# EAGLE design DRV10987 (EAGLE 8.7.1)
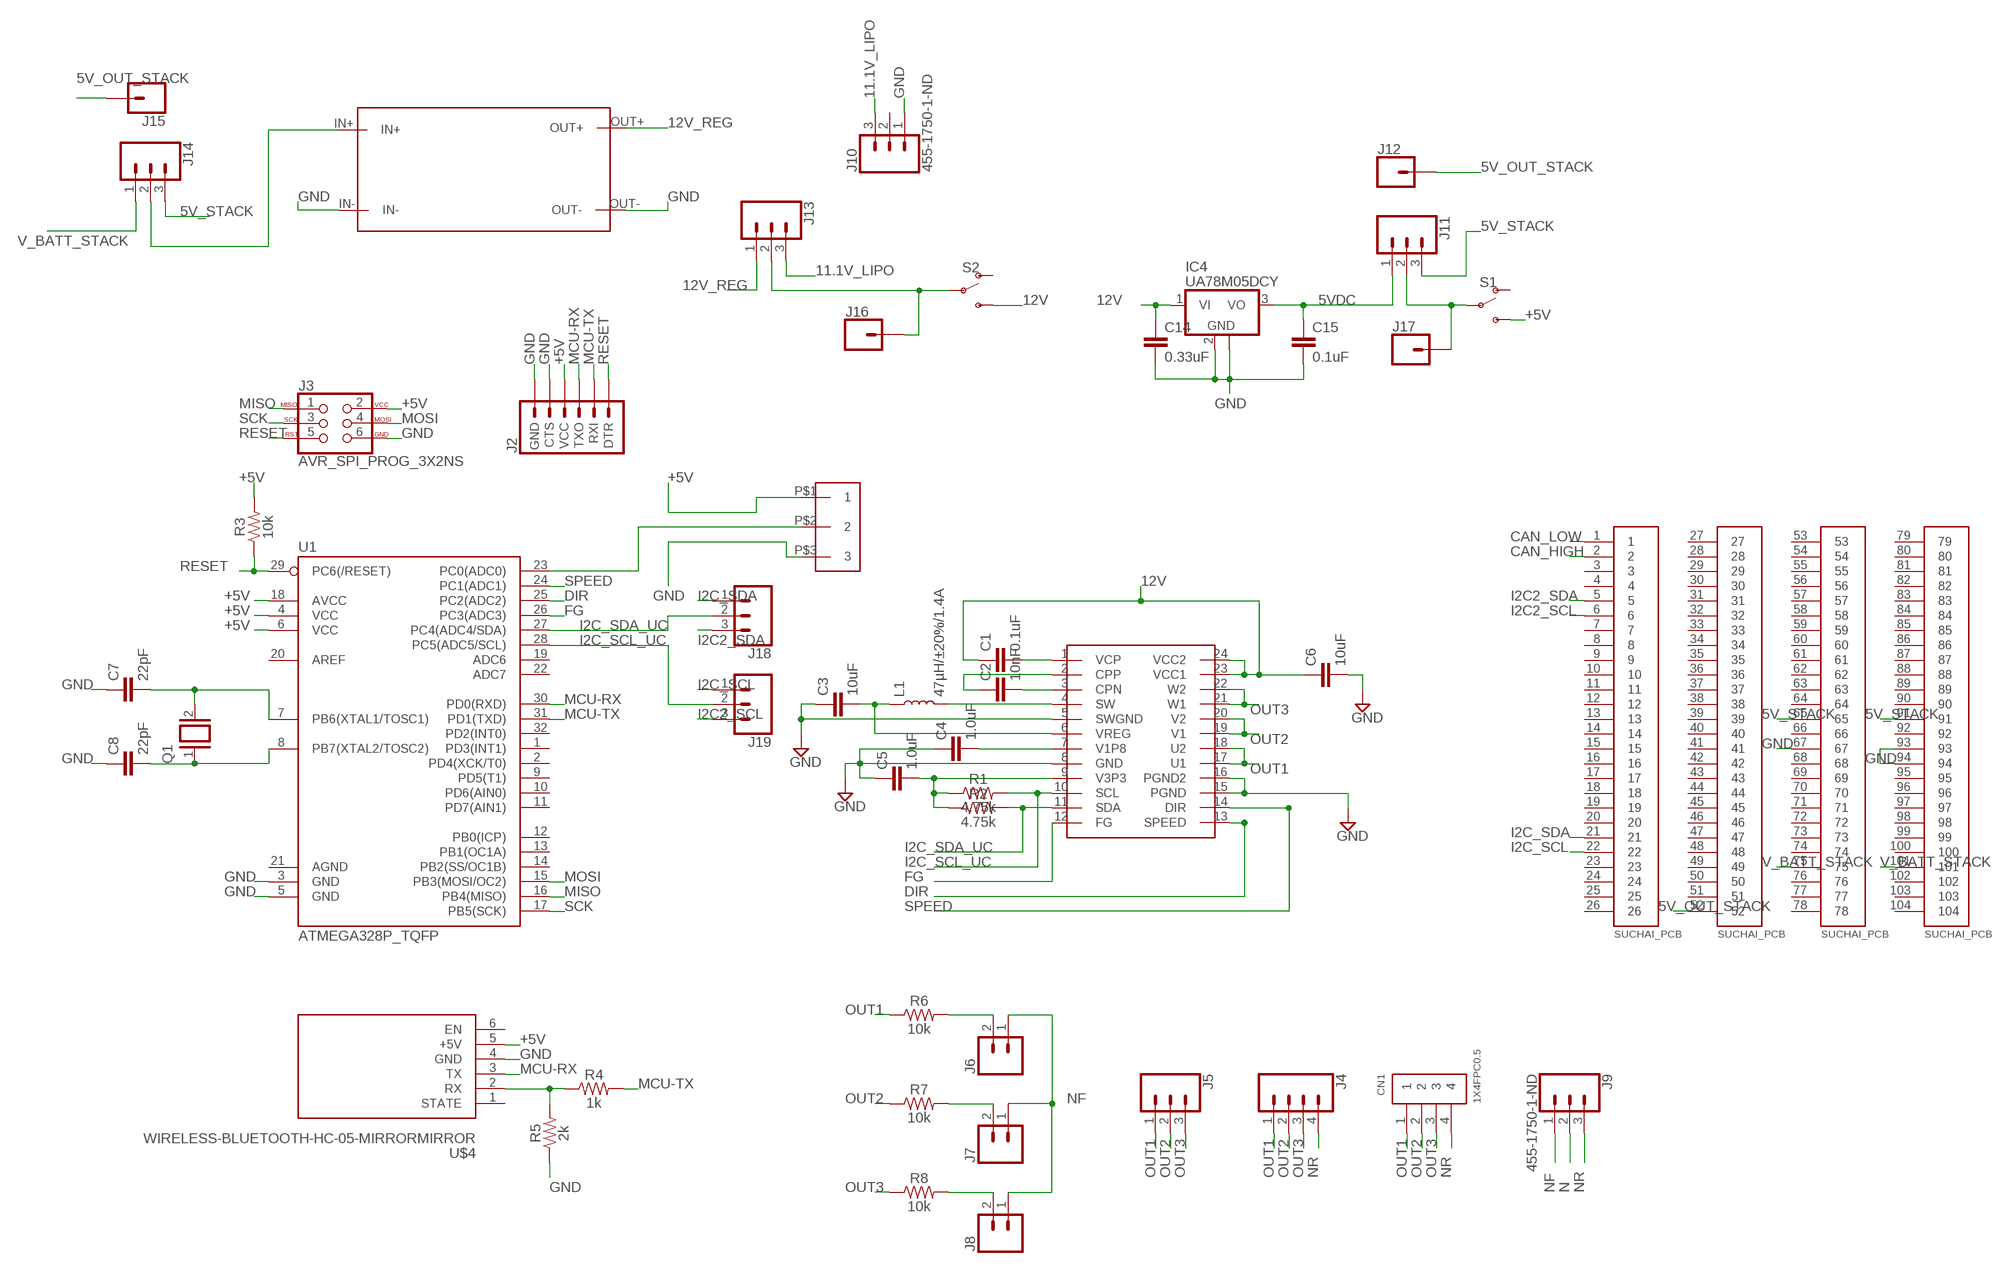
[diagram p0: schematic, sheet 1]

## Parts
C1  0.1uF  1.0UF-0805-25V-10%  [0805]
C2  10nF  1.0UF-0805-25V-10%  [0805]
C3  10uF  1.0UF-0805-25V-10%  [0805]
C4  1.0uF  1.0UF-0805-25V-10%  [0805]
C5  1.0uF  1.0UF-0805-25V-10%  [0805]
C6  10uF  1.0UF-0805-25V-10%  [0805]
C7  22pF  2.2UF-1206-50V-10%  [1206]
C8  22pF  2.2UF-1206-50V-10%  [1206]
C14  0.33uF  1.0UF-1206-50V-10%  [1206]
C15  0.1uF  1.0UF-1206-50V-10%  [1206]
CN1  1X4FPC0.5  [FPC_0.5MM-4]
IC4  UA78M05DCY  [SOT223]
J1  SUCHAI_PCB  [SUCHAI_PCB]
J2  6_PIN_SERIAL_TARGET  [1X06]
J3  AVR_SPI_PROG_3X2NS  [2X3-NS]
J4  CONN_04  [1X04]
J5  CONN_03-SCREW-5MM  [SCREWTERMINAL-5MM-3]
J6  CONN_02  [1X02]
J7  CONN_02  [1X02]
J8  CONN_02  [1X02]
J9  455-1750-1-ND  CONN_03  [1X03]
J10  455-1750-1-ND  CONN_03  [1X03]
J11  CONN_03LOCK  [1X03_LOCK]
J12  CONN_01  [1X01]
J13  CONN_03LOCK  [1X03_LOCK]
J14  CONN_03LOCK  [1X03_LOCK]
J15  CONN_01  [1X01]
J16  CONN_01  [1X01]
J17  CONN_01  [1X01]
J18  CONN_03LOCK  [1X03_LOCK]
J19  CONN_03LOCK  [1X03_LOCK]
L1  47µH/±20%/1.4A  INDUCTOR-SRN6045-33UH  [SRN6045]
Q1  XTAL/S  [QS]
R1  4.75k  RESISTOR0805  [0805]
R2  4.75k  RESISTOR0805  [0805]
R3  10k  RESISTOR1206  [1206]
R4  1k  1KOHM-HORIZ-1/4W-5%  [AXIAL-0.3]
R5  2k  RESISTORAXIAL-0.3  [AXIAL-0.3]
R6  10k  10KOHM-HORIZ-1/4W-1%  [AXIAL-0.3]
R7  10k  10KOHM-HORIZ-1/4W-1%  [AXIAL-0.3]
R8  10k  10KOHM-HORIZ-1/4W-1%  [AXIAL-0.3]
S1  SWITCH-SPDT-PTH-11.6X4.0MM  [SWITCH_SPDT_PTH_11.6X4.0MM]
S2  SWITCH-SPDT-PTH-11.6X4.0MM  [SWITCH_SPDT_PTH_11.6X4.0MM]
U1  ATMEGA328P_TQFP  [TQFP32-08]
U$1  DRV10987  [DRV10987]
U$2  XL6009E1_MODULE  [XL6009E1_MODULE]
U$3  CONN_03_SMD_SMALL  [CONN_03_SMD_SMALL]
U$4  WIRELESS-BLUETOOTH-HC-05-MIRRORMIRROR  [WIRELESS-BLUETOOTH-HC-05-MIRROR]

## Nets
5V_OUT_STACK: J1.52 J12.1 J15.1
5V_STACK: J1.65 J1.91 J11.3 J14.3
5VDC: C15.1 IC4.3(VO) J11.1
11.1V_LIPO: J10.3 J13.3
12V: C1.1 C6.1 C14.1 IC4.1(VI) S2.3(S) U$1.23(VCC1) U$1.24(VCC2)
12V_REG: J13.1 U$2.OUT+
+5V: J2.4(VCC) J3.2 R3.2 S1.3(S) U1.4(VCC) U1.6(VCC) U1.18(AVCC) U$3.P$1 U$4.5(+5V)
CAN_HIGH: J1.2
CAN_LOW: J1.1
DIR: U1.25(PC2(ADC2)) U$1.13(SPEED)
FG: U1.26(PC3(ADC3)) U$1.12(FG)
GND: C3.1 C4.1 C5.1 C6.2 C7.1 C8.1 C14.2 C15.2 IC4.2(GND) IC4.4(GND) J1.67 J1.93 J1.94 J2.5(CTS) J2.6(GND) J3.6 J10.1 R5.P$1 U1.3(GND) U1.5(GND) U$1.5(SWGND) U$1.8(GND) U$1.15(PGND) U$1.16(PGND2) U$2.IN- U$2.OUT- U$3.P$3 U$4.4(GND)
I2C2_SCL: J1.6 J19.3
I2C2_SDA: J1.5 J18.3
I2C_SCL: J1.22 J19.1
I2C_SCL_UC: J19.2 R1.2 U1.28(PC5(ADC5/SCL)) U$1.10(SCL)
I2C_SDA: J1.21 J18.1
I2C_SDA_UC: J18.2 R2.2 U1.27(PC4(ADC4/SDA)) U$1.11(SDA)
MCU-RX: J2.3(TXO) U1.30(PD0(RXD)) U$4.3(TX)
MCU-TX: J2.2(RXI) R4.P$2 U1.31(PD1(TXD))
MISO: J3.1 U1.16(PB4(MISO))
MOSI: J3.4 U1.15(PB3(MOSI/OC2))
N: J9.2
N$1: C1.2 U$1.1(VCP)
N$2: C2.1 U$1.2(CPP)
N$3: C2.2 U$1.3(CPN)
N$4: L1.2 U$1.4(SW)
N$5: J11.2 J17.1 S1.2(P)
N$6: C3.2 L1.1 U$1.6(VREG)
N$7: C4.2 U$1.7(V1P8)
N$8: C7.2 Q1.2 U1.7(PB6(XTAL1/TOSC1))
N$9: C5.2 R1.1 R2.1 U$1.9(V3P3)
N$10: C8.2 Q1.1 U1.8(PB7(XTAL2/TOSC2))
N$11: J7.2 R7.P$2
N$12: J6.2 R6.P$2
N$13: R4.P$1 R5.P$2 U$4.2(RX)
N$14: U1.23(PC0(ADC0)) U$3.P$2
N$15: J8.2 R8.P$2
N$16: J13.2 J16.1 S2.2(P)
N$18: J14.2 U$2.IN+
NF: J6.1 J7.1 J8.1 J9.1
NR: CN1.4 J4.4 J9.3
OUT1: CN1.1 J4.1 J5.1 R6.P$1 U$1.17(U1) U$1.18(U2)
OUT2: CN1.2 J4.2 J5.2 R7.P$1 U$1.19(V1) U$1.20(V2)
OUT3: CN1.3 J4.3 J5.3 R8.P$1 U$1.21(W1) U$1.22(W2)
RESET: J2.1(DTR) J3.5 R3.1 U1.29(PC6(/RESET))
SCK: J3.3 U1.17(PB5(SCK))
SPEED: U1.24(PC1(ADC1)) U$1.14(DIR)
V_BATT_STACK: J1.75 J1.101 J14.1
Unconnected: J1.3 J1.4 J1.7 J1.8 J1.9 J1.10 J1.11 J1.12 J1.13 J1.14 J1.15 J1.16 J1.17 J1.18 J1.19 J1.20 J1.23 J1.24 J1.25 J1.26 J1.27 J1.28 J1.29 J1.30 J1.31 J1.32 J1.33 J1.34 J1.35 J1.36 J1.37 J1.38 J1.39 J1.40 J1.41 J1.42 J1.43 J1.44 J1.45 J1.46 J1.47 J1.48 J1.49 J1.50 J1.51 J1.53 J1.54 J1.55 J1.56 J1.57 J1.58 J1.59 J1.60 J1.61 J1.62 J1.63 J1.64 J1.66 J1.68 J1.69 J1.70 J1.71 J1.72 J1.73 J1.74 J1.76 J1.77 J1.78 J1.79 J1.80 J1.81 J1.82 J1.83 J1.84 J1.85 J1.86 J1.87 J1.88 J1.89 J1.90 J1.92 J1.95 J1.96 J1.97 J1.98 J1.99 J1.100 J1.102 J1.103 J1.104 J10.2 S1.1(O) S2.1(O) U1.1(PD3(INT1)) U1.2(PD4(XCK/T0)) U1.9(PD5(T1)) U1.10(PD6(AIN0)) U1.11(PD7(AIN1)) U1.12(PB0(ICP)) U1.13(PB1(OC1A)) U1.14(PB2(SS/OC1B)) U1.19(ADC6) U1.20(AREF) U1.21(AGND) U1.22(ADC7) U1.32(PD2(INT0)) U$4.1(STATE) U$4.6(EN)

## Library data of the parts
C1-C3 C6 = SparkFun-Capacitors:1.0UF: 1µF ceramic capacitors A capacitor is a passive two-terminal electrical component used to store electrical energy temporarily in an electric field.; PROD_ID: CAP-08064; VALUE: 1.0uF
C4 C5 = SparkFun-Capacitors:1.0UF: 1µF ceramic capacitors A capacitor is a passive two-terminal electrical component used to store electrical energy temporarily in an electric field.; PROD_ID: CAP-08064
C7 C8 = SparkFun-Capacitors:2.2UF: 2.2µF ceramic capacitors A capacitor is a passive two-terminal electrical component used to store electrical energy temporarily in an electric field.; PROD_ID: CAP-10009; VALUE: 2.2uF
C14 C15 = SparkFun-Capacitors:1.0UF: 1µF ceramic capacitors A capacitor is a passive two-terminal electrical component used to store electrical energy temporarily in an electric field.; PROD_ID: CAP-09822; VALUE: 1.0uF
CN1 = adafruit:1X4: 4-pin connector
IC4 = linear:UA78M*: POSITIVE-VOLTAGE REGULATORS Source: http://focus.ti.com/lit/ds/symlink/ua78m33.pdf
J1 = SUCHAI_PCB:SUCHAI_PCB: ASSEMBLY, SOCKET STRIP .016 X .031 TAIL.
J2 = SparkFun-Connectors:6_PIN_SERIAL_TARGET: 6-pin header connection for use with the "FTDI BASIC" pinout - TARGET SIDE. Also known as "Arduino Serial Program Header". It is used to mate with our FTDI Basic serial programmers using the Arduino IDE. Note, this device has "TARGET" in the name. It is intended to be used on a design that contains a target micro-controller that you wish to program. The "sister" device, named "CABLE" is inteneded to be used on a design that usually lives on the end of your USB cable and prvides the converter chip (FTDI232 or FTDI231x) to commnicate serial RX/TX. You can populate with some of these: Break Away Headers - Straight <https://www.sparkfun.com/products/116> (PRT-00116) For reference (or to suit your programming needs) check out these designs: SparkFun FTDI Basic Breakout - 5V <https://www.sparkfun.com/products/9716> (DEV-09716) SparkFun FTDI Basic Breakout - 3.3V <https://www.sparkfun.com/products/9873> (DEV-09873) SparkFun FTDI SmartBasic <https://www.sparkfun.com/products/12935> (DEV-12935) SparkFun Beefy 3 - FTDI Basic Breakout <https://www.sparkfun.com/products/13746> (DEV-13746)
J3 = SparkFun-Connectors:AVR_SPI_PROG_3X2: AVR ISP 6 Pin This is the reduced ISP connector for AVR programming. Common on Arduino. This footprint will take up less PCB space and can be used with a 10-pin to 6-pin adapter such as SKU: BOB-08508 **Special note about "TEST_POINT" package. The stop mask is on the top side, so if you want your programming test points to be on the bottom of your board, make sure to place this package on the bottom side of the board. This also ensure that the orientation to program from the bottom side will be correct. SparkFun Products: SparkFun ISP Pogo Adapter <https://www.sparkfun.com/products/11591> - NS Tiny AVR Programmer <https://www.sparkfun.com/products/11801> -PTH
J4 = SparkFun-Connectors:CONN_04: Multi connection point. Often used as Generic Header-pin footprint for 0.1 inch spaced/style header connections On any of the 0.1 inch spaced packages, you can populate with these: Break Away Headers - Straight <https://www.sparkfun.com/products/116> (PRT-00116) Break Away Male Headers - Right Angle <https://www.sparkfun.com/products/553> (PRT-00553) Female Headers <https://www.sparkfun.com/products/115> (PRT-00115) Break Away Headers - Machine Pin <https://www.sparkfun.com/products/117> (PRT-00117) Break Away Female Headers - Swiss Machine Pin <https://www.sparkfun.com/products/743> (PRT-00743) For SCREWTERMINALS and SPRING TERMINALS visit here: Screw Terimnals on SparkFun.com <https://www.sparkfun.com/search/results?term=Screw+Terminals> (5mm/3.5mm/2.54mm spacing) This device is also useful as a general connection point to wire up your design to another part of your project. Our various solder wires solder well into these plated through hole pads. Hook-Up Wire - Assortment (Stranded, 22 AWG) <https://www.sparkfun.com/products/11375> (PRT-11375) Hook-Up Wire - Assortment (Solid Core, 22 AWG) <https://www.sparkfun.com/products/11367> (PRT-11367) View the entire wire category on our website here <https://www.sparkfun.com/categories/141> Special notes: Molex polarized connector foot print use with SKU : PRT-08231 with associated crimp pins and housings. 1MM SMD Version SKU: PRT-10208; PROD_ID: CONN-09696
J5 = SparkFun-Connectors:CONN_03: Multi connection point. Often used as Generic Header-pin footprint for 0.1 inch spaced/style header connections On any of the 0.1 inch spaced packages, you can populate with these: Break Away Headers - Straight <https://www.sparkfun.com/products/116> (PRT-00116) Break Away Male Headers - Right Angle <https://www.sparkfun.com/products/553> (PRT-00553) Female Headers <https://www.sparkfun.com/products/115> (PRT-00115) Break Away Headers - Machine Pin <https://www.sparkfun.com/products/117> (PRT-00117) Break Away Female Headers - Swiss Machine Pin <https://www.sparkfun.com/products/743> (PRT-00743) Stackable Header - 3 Pin (Female, 0.1") <https://www.sparkfun.com/products/13875> (PRT-13875) For SCREWTERMINALS and SPRING TERMINALS visit here: Screw Terimnals on SparkFun.com <https://www.sparkfun.com/search/results?term=Screw+Terminals> (5mm/3.5mm/2.54mm spacing) This device is also useful as a general connection point to wire up your design to another part of your project. Our various solder wires solder well into these plated through hole pads. Hook-Up Wire - Assortment (Stranded, 22 AWG) <https://www.sparkfun.com/products/11375> (PRT-11375) Hook-Up Wire - Assortment (Solid Core, 22 AWG) <https://www.sparkfun.com/products/11367> (PRT-11367) View the entire wire category on our website here <https://www.sparkfun.com/categories/141> Special notes: Molex polarized connector foot print use with SKU : PRT-08232 with associated crimp pins and housings.; PROD_ID: CONN-10134; SF_SKU: PRT-08433
J6-J8 = SparkFun-Connectors:CONN_02: Multi connection point. Often used as Generic Header-pin footprint for 0.1 inch spaced/style header connections On any of the 0.1 inch spaced packages, you can populate with these: Break Away Headers - Straight <https://www.sparkfun.com/products/116> (PRT-00116) Break Away Male Headers - Right Angle <https://www.sparkfun.com/products/553> (PRT-00553) Female Headers <https://www.sparkfun.com/products/115> (PRT-00115) Break Away Headers - Machine Pin <https://www.sparkfun.com/products/117> (PRT-00117) Break Away Female Headers - Swiss Machine Pin <https://www.sparkfun.com/products/743> (PRT-00743) For SCREWTERMINALS and SPRING TERMINALS visit here: Screw Terimnals on SparkFun.com <https://www.sparkfun.com/search/results?term=Screw+Terminals> (5mm/3.5mm/2.54mm spacing) This device is also useful as a general connection point to wire up your design to another part of your project. Our various solder wires solder well into these plated through hole pads. Hook-Up Wire - Assortment (Stranded, 22 AWG) <https://www.sparkfun.com/products/11375> (PRT-11375) Hook-Up Wire - Assortment (Solid Core, 22 AWG) <https://www.sparkfun.com/products/11367> (PRT-11367) View the entire wire category on our website here <https://www.sparkfun.com/categories/141> Special notes: Molex polarized connector foot print use with: PRT-08233 with associated crimp pins and housings. 2.54_SCREWTERM for use with PRT-10571. 3.5mm Screw Terminal footprints for PRT-08084 5mm Screw Terminal footprints for use with PRT-08432
J9 J10 = SparkFun-Connectors:CONN_03: Multi connection point. Often used as Generic Header-pin footprint for 0.1 inch spaced/style header connections On any of the 0.1 inch spaced packages, you can populate with these: Break Away Headers - Straight <https://www.sparkfun.com/products/116> (PRT-00116) Break Away Male Headers - Right Angle <https://www.sparkfun.com/products/553> (PRT-00553) Female Headers <https://www.sparkfun.com/products/115> (PRT-00115) Break Away Headers - Machine Pin <https://www.sparkfun.com/products/117> (PRT-00117) Break Away Female Headers - Swiss Machine Pin <https://www.sparkfun.com/products/743> (PRT-00743) Stackable Header - 3 Pin (Female, 0.1") <https://www.sparkfun.com/products/13875> (PRT-13875) For SCREWTERMINALS and SPRING TERMINALS visit here: Screw Terimnals on SparkFun.com <https://www.sparkfun.com/search/results?term=Screw+Terminals> (5mm/3.5mm/2.54mm spacing) This device is also useful as a general connection point to wire up your design to another part of your project. Our various solder wires solder well into these plated through hole pads. Hook-Up Wire - Assortment (Stranded, 22 AWG) <https://www.sparkfun.com/products/11375> (PRT-11375) Hook-Up Wire - Assortment (Solid Core, 22 AWG) <https://www.sparkfun.com/products/11367> (PRT-11367) View the entire wire category on our website here <https://www.sparkfun.com/categories/141> Special notes: Molex polarized connector foot print use with SKU : PRT-08232 with associated crimp pins and housings.; PROD_ID: XXX-00000
J11 J13 J14 J18 J19 = SparkFun-Connectors:CONN_03: Multi connection point. Often used as Generic Header-pin footprint for 0.1 inch spaced/style header connections On any of the 0.1 inch spaced packages, you can populate with these: Break Away Headers - Straight <https://www.sparkfun.com/products/116> (PRT-00116) Break Away Male Headers - Right Angle <https://www.sparkfun.com/products/553> (PRT-00553) Female Headers <https://www.sparkfun.com/products/115> (PRT-00115) Break Away Headers - Machine Pin <https://www.sparkfun.com/products/117> (PRT-00117) Break Away Female Headers - Swiss Machine Pin <https://www.sparkfun.com/products/743> (PRT-00743) Stackable Header - 3 Pin (Female, 0.1") <https://www.sparkfun.com/products/13875> (PRT-13875) For SCREWTERMINALS and SPRING TERMINALS visit here: Screw Terimnals on SparkFun.com <https://www.sparkfun.com/search/results?term=Screw+Terminals> (5mm/3.5mm/2.54mm spacing) This device is also useful as a general connection point to wire up your design to another part of your project. Our various solder wires solder well into these plated through hole pads. Hook-Up Wire - Assortment (Stranded, 22 AWG) <https://www.sparkfun.com/products/11375> (PRT-11375) Hook-Up Wire - Assortment (Solid Core, 22 AWG) <https://www.sparkfun.com/products/11367> (PRT-11367) View the entire wire category on our website here <https://www.sparkfun.com/categories/141> Special notes: Molex polarized connector foot print use with SKU : PRT-08232 with associated crimp pins and housings.
J12 J15-J17 = SparkFun-Connectors:CONN_01: Single connection point. Often used as Generic Header-pin footprint for 0.1 inch spaced/style header connections On any of the 0.1 inch spaced packages, you can populate with these: Break Away Headers - Straight <https://www.sparkfun.com/products/116> (PRT-00116) Break Away Male Headers - Right Angle <https://www.sparkfun.com/products/553> (PRT-00553) Female Headers <https://www.sparkfun.com/products/115> (PRT-00115) Break Away Headers - Machine Pin <https://www.sparkfun.com/products/117> (PRT-00117) Break Away Female Headers - Swiss Machine Pin <https://www.sparkfun.com/products/743> (PRT-00743) This device is also useful as a general connection point to wire up your design to another part of your project. Our various solder wires solder well into these plated through hole pads. Hook-Up Wire - Assortment (Stranded, 22 AWG) <https://www.sparkfun.com/products/11375> (PRT-11375) Hook-Up Wire - Assortment (Solid Core, 22 AWG) <https://www.sparkfun.com/products/11367> (PRT-11367) View the entire wire category on our website here <https://www.sparkfun.com/categories/141> Special notes: SMTSO-256-ET is a "flush mount" nut for a 4-40 screw. We mostly use this on specialty testbeds; it is a nice way to connect hardware to your PCB at an adjustable hieght. Also note, the SNAP packages are for using a snappable style connector. We sell a baggie of snaps and they are also used on two LilyPad designs: Snap Assortment - 30 pack (male and female) <https://www.sparkfun.com/products/11347> (DEV-11347) LilyPad Arduino SimpleSnap <https://www.sparkfun.com/products/10941> (DEV-10941) LilyPad SimpleSnap Protoboard <https://www.sparkfun.com/products/10940> (DEV-10940)
L1 = SparkFun-Coils:INDUCTOR: Inductors Resist changes in electrical current. Basically a coil of wire. SparkFun Products: SparkFun Load Cell Amplifier - HX711 <https://www.sparkfun.com/products/13879> IOIO-OTG - V2.2 <https://www.sparkfun.com/products/13613>; PROD_ID: NDUC-11627; VALUE: 33µH/±20%/1.4A
Q1 = special:XTAL/S: CRYSTAL
R1-R3 = SparkFun-Resistors:RESISTOR: Generic Resistor Package
R4 = resistors-longpads:1KOHM: 1kΩ resistor A resistor is a passive two-terminal electrical component that implements electrical resistance as a circuit element. Resistors act to reduce current flow, and, at the same time, act to lower voltage levels within circuits. - Wikipedia; PROD_ID: RES-08380
R5 = resistors-longpads:RESISTOR: Generic Resistor Package
R6-R8 = SparkFun-Resistors:10KOHM: 10kΩ resistor A resistor is a passive two-terminal electrical component that implements electrical resistance as a circuit element. Resistors act to reduce current flow, and, at the same time, act to lower voltage levels within circuits. - Wikipedia; PROD_ID: RES-12183
S1 S2 = SparkFun-Switches:SWITCH-SPDT: Single Pole, Double Throw (SPDT) Switch Single-pole, double-throw (SPDT) switch. Variant Overview SMD-AYZ0202 Surface Mount DPDT Switch <https://www.sparkfun.com/products/597> (COM-00597) Used on e.g. LilyPad Arduino USB - ATmega32U4 Board <https://www.sparkfun.com/products/12049> PTH-11.6X4.0MM SPDT Mini Power Switch <https://www.sparkfun.com/products/102> (COM-00102) Used on e.g. SparkFun Simon Says - Through-Hole Soldering Kit <https://www.sparkfun.com/products/10547> (KIT-10547) PTH-11.6X4.0MM-KIT KIT version of SPDT Mini Power Switch - Simplifies soldering by removing tStop of switch pins - only one side can be soldered. PTH-11.6X4.0MM-LOCK LOCK version of SPDT Mini Power Switch - Offset pins hold switch in place for easier soldering. SMD-RIGHT-ANGLE Surface Mount Right Angle Switch <https://www.sparkfun.com/products/10860> (COM-10860) Used on e.g. SparkFun ESP8266 Thing <https://www.sparkfun.com/products/13231>; PROD_ID: SWCH-08261; SF_SKU: COM-00102
U1 = SparkFun-IC-Microcontroller:ATMEGA328P_TQFP: Popular 328P in QFP Storefront component: ATmega328 - TQFP <https://www.sparkfun.com/products/13448> (COM-13448) Datasheet <http://www.sparkfun.com/datasheets/Components/SMD/ATMega328.pdf> SparkFun Products SparkFun RedBoard - Programmed with Arduino <https://www.sparkfun.com/products/12757> (DEV-12757) Arduino Pro Mini 328 - 5V/16MHz <https://www.sparkfun.com/products/11113> (DEV-11113) Arduino Pro Mini 328 - 3.3V/8MHz <https://www.sparkfun.com/products/11114> (DEV-11114) SparkFun OpenLog <https://www.sparkfun.com/products/13712> (DEV-13712) SparkFun MicroView - OLED Arduino Module <https://www.sparkfun.com/products/12923> (DEV-12923) SparkFun Digital Sandbox <https://www.sparkfun.com/products/12651> (DEV-12651) SparkFun PicoBoard <https://www.sparkfun.com/products/11888> (WIG-11888) Arduino Fio <https://www.sparkfun.com/products/10116> (DEV-10116) LilyPad Arduino 328 Main Board <https://www.sparkfun.com/products/13342> (DEV-13342) SparkFun RedStick <https://www.sparkfun.com/products/13741> (DEV-13741) LilyPad MP3 <https://www.sparkfun.com/products/11013> (DEV-11013) LilyPad Arduino SimpleSnap <https://www.sparkfun.com/products/10941> (DEV-10941) SparkFun Stepoko <https://www.sparkfun.com/products/13899> (ROB-13899) SparkFun Geiger Counter <https://www.sparkfun.com/products/11345> (SEN-11345) SparkFun EL Sequencer <https://www.sparkfun.com/products/12781> (COM-12781) Arduino Pro 328 - 5V/16MHz <https://www.sparkfun.com/products/10915> (DEV-10915) CryptoCape <https://www.sparkfun.com/products/12773> (DEV-12773) SparkFun IR Thermometer Evaluation Board - MLX90614 <https://www.sparkfun.com/products/10740> (SEN-10740) SparkFun RedBot Mainboard <https://www.sparkfun.com/products/12097> (ROB-12097) Arduino Pro 328 - 3.3V/8MHz <https://www.sparkfun.com/products/10914> (DEV-10914) SparkFun Block for Intel® Edison - Arduino <https://www.sparkfun.com/products/13036> (DEV-13036) SparkFun Simon Says - Surface Mount Soldering Kit <https://www.sparkfun.com/products/10935> (KIT-10935) SparkFun 7-Segment Serial Display - Red <https://www.sparkfun.com/products/11441> (COM-11441) SparkFun 7-Segment Serial Display - White <https://www.sparkfun.com/products/11629> (COM-11629) SparkFun 7-Segment Serial Display - Yellow <https://www.sparkfun.com/products/11443> (COM-11443) SparkFun 7-Segment Serial Display - Kelly Green <https://www.sparkfun.com/products/11440> (COM-11440) SparkFun 7-Segment Serial Display - Blue <https://www.sparkfun.com/products/11442> (COM-11442) SparkFun OpenSegment Serial Display - 20mm (Blue) <https://www.sparkfun.com/products/11647> (COM-11647) SparkFun OpenSegment Serial Display - 20mm (Green) <https://www.sparkfun.com/products/11646> (COM-11646) SparkFun OpenSegment Serial Display - 20mm (White) <https://www.sparkfun.com/products/11648> (COM-11648) SparkFun OpenSegment Serial Display - 20mm (Red) <https://www.sparkfun.com/products/11644> (COM-11644) SparkFun OpenSegment Serial Display - 20mm (Yellow) <https://www.sparkfun.com/products/11645> (COM-11645) SparkFun OpenSegment Shield <https://www.sparkfun.com/products/13190> (DEV-13190); PROD_ID: IC-09069
U$1 = BLDC_DRIVER:DRV10987
U$2 = BLDC_DRIVER:XL6009E1_MODULE: High-performance step-up switching current (BOOST) module. Input Range 3V ~ 32V Output Range 5V ~ 35V Input Current 4A max Conversion efficiency ~94% Switching frequency 400KHz Working temperature -40 ° C ~ +85 ° C Dimensions 43mm * 21mm * 14mm (length * width* height)
U$3 = BLDC_DRIVER:CONN_03_SMD_SMALL
U$4 = diy-modules:WIRELESS-BLUETOOTH-HC-05-MIRROR: Bluetooth Transceiver Module based on HC-05 board Tutorial is available here: https://arduino-info.wikispaces.com/BlueTooth-HC05-HC06-Modules-How-To Click here to find device on ebay.com <http://www.ebay.com/sch/hc-05+module+rs232>

## Board
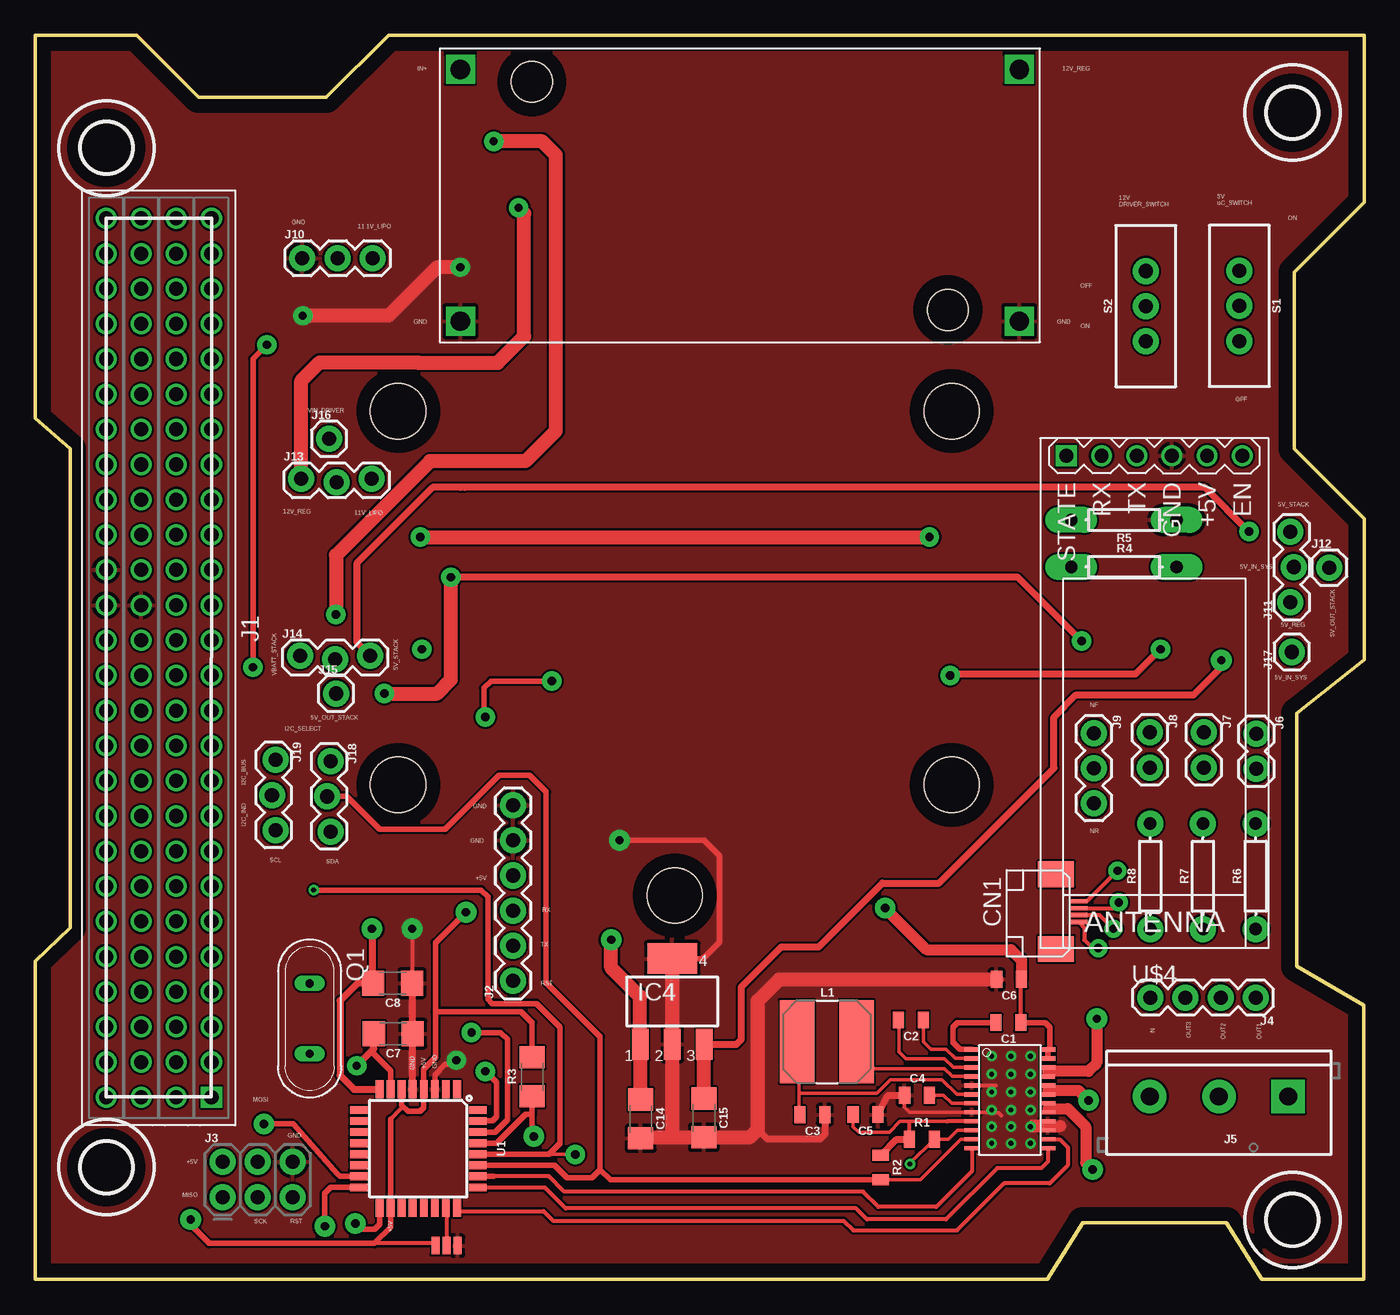
[diagram p1: board, top side]
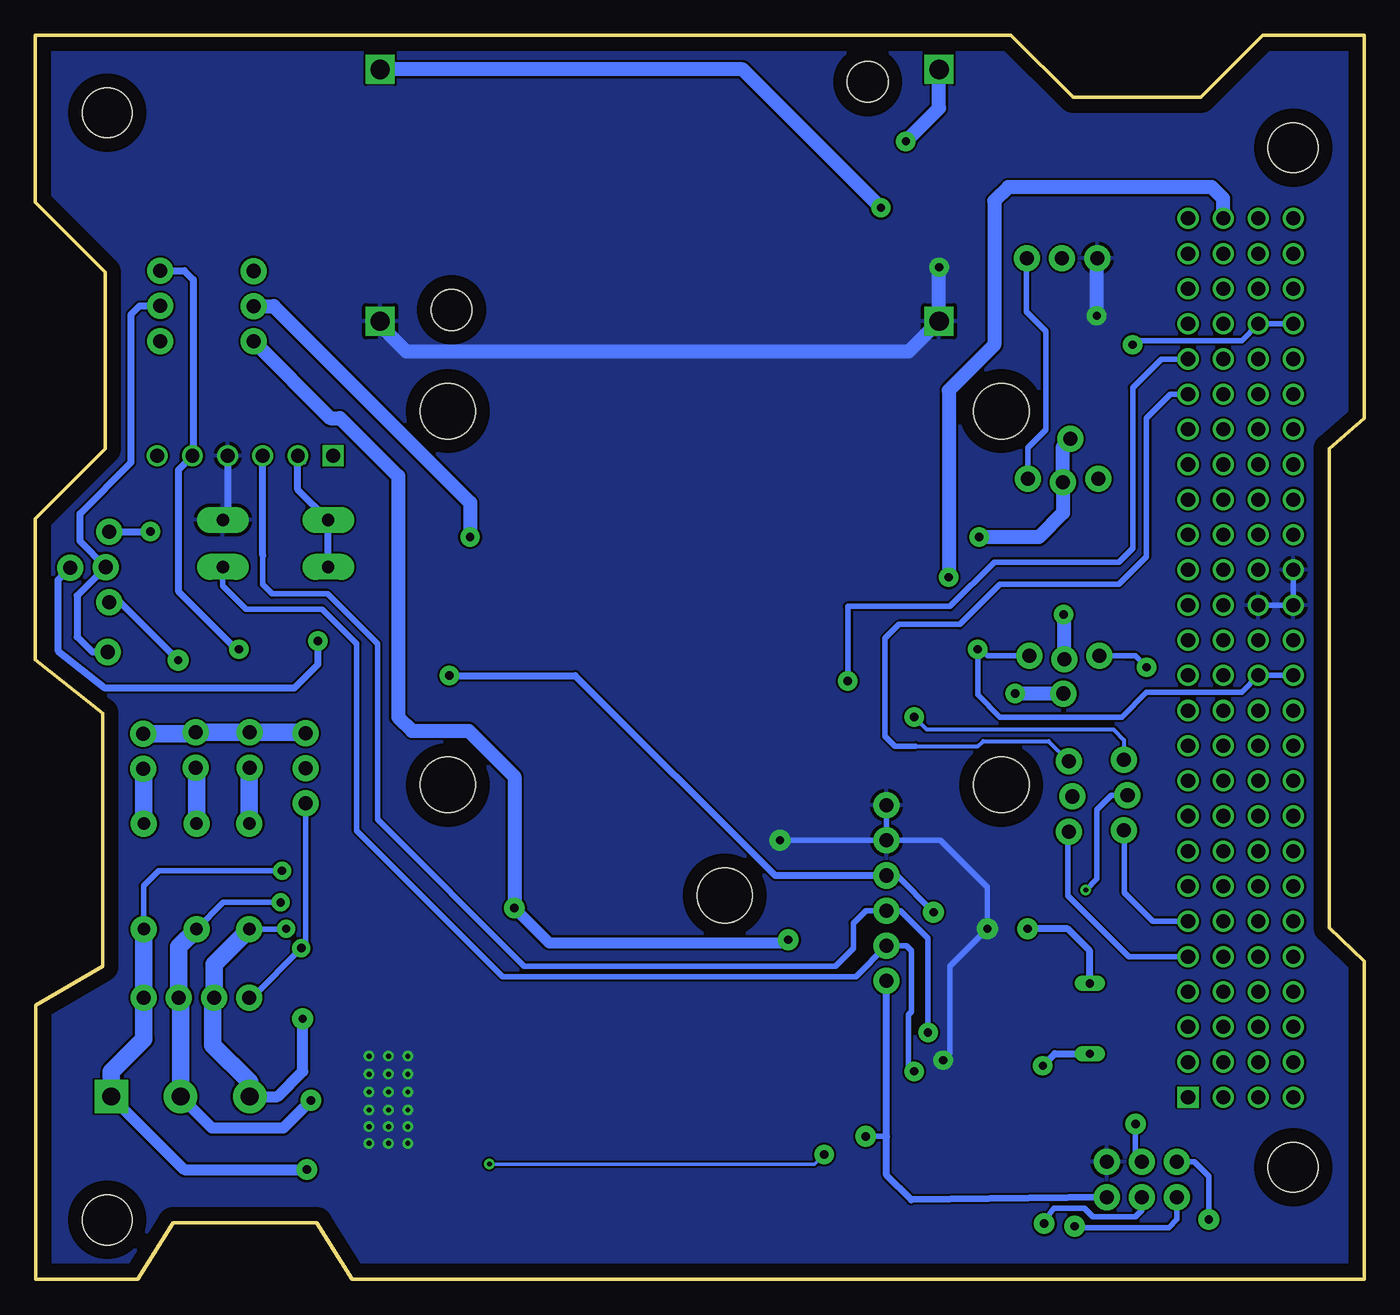
[diagram p2: board, bottom side, seen from below]

Size 96.16 x 90.01 mm. Coordinates in mm from the lower left corner, seen from the top.
Copper layers (1*16): Top 0.035mm / dielectric 1.5mm / Bottom 0.035mm
Design rules "default *": minimum track width 0.2mm, minimum drill 0.35mm, track to track 6mil, track to pad 6mil, pad to pad 6mil, via to via 6mil, smd to smd 6mil, copper to edge 40mil, drill to drill 6mil, minimum pad ring 10mil, minimum via ring 8mil, stop-mask expansion 4mil, vias tented up to drill 0mil, thermal gap 10mil
Holes 4 mm at 26.28,62.79 66.28,62.79 46.28,27.79 66.28,35.79 26.28,35.79

### Footprints (pad centres in the part's own frame; a part is rotated, then mirrored left to right if it is on the bottom)
0805 = smd 0.8 x 1.2: 1 -0.9,0; 2 0.9,0
1206 = smd 1.6 x 1.8: 1 -1.4,0; 2 1.4,0
FPC_0.5MM-4 = smd 0.3 x 1.25: 1 -0.75,-0.45; 2 -0.25,-0.45; 3 0.25,-0.45; 4 0.75,-0.45 | smd 1.85 x 2.6: MT -2.7,-2.1; MT2 2.7,-2.1
SOT223 = smd 1.219 x 2.235: 1 -2.311,-3.099; 2 0,-3.099; 3 2.311,-3.099 | smd 3.6 x 2.2: 4 0,3.099
SUCHAI_PCB = drill 1.016 pad 1.524 square: 1 12.72,13.16 | drill 1.016 pad 1.524: 2 12.72,15.7; 3 12.72,18.24; 4 12.72,20.78; 5 12.72,23.32; 6 12.72,25.86; 7 12.72,28.4; 8 12.72,30.94; 9 12.72,33.48; 10 12.72,36.02; 11 12.72,38.56; 12 12.72,41.1; 13 12.72,43.64; 14 12.72,46.18; 15 12.72,48.72; 16 12.72,51.26; 17 12.72,53.8; 18 12.72,56.34; 19 12.72,58.88; 20 12.72,61.42; 21 12.72,63.96; 22 12.72,66.5; 23 12.72,69.04; 24 12.72,71.58; 25 12.72,74.12; 26 12.72,76.66; 27 10.18,13.16; 28 10.18,15.7; 29 10.18,18.24; 30 10.18,20.78; 31 10.18,23.32; 32 10.18,25.86; 33 10.18,28.4; 34 10.18,30.94; 35 10.18,33.48; 36 10.18,36.02; 37 10.18,38.56; 38 10.18,41.1; 39 10.18,43.64; 40 10.18,46.18; 41 10.18,48.72; 42 10.18,51.26; 43 10.18,53.8; 44 10.18,56.34; 45 10.18,58.88; 46 10.18,61.42; 47 10.18,63.96; 48 10.18,66.5; 49 10.18,69.04; 50 10.18,71.58; 51 10.18,74.12; 52 10.18,76.66; 53 7.64,13.16; 54 7.64,15.7; 55 7.64,18.24; 56 7.64,20.78; 57 7.64,23.32; 58 7.64,25.86; 59 7.64,28.4; 60 7.64,30.94; 61 7.64,33.48; 62 7.64,36.02; 63 7.64,38.56; 64 7.64,41.1; 65 7.64,43.64; 66 7.64,46.18; 67 7.64,48.72; 68 7.64,51.26; 69 7.64,53.8; 70 7.64,56.34; 71 7.64,58.88; 72 7.64,61.42; 73 7.64,63.96; 74 7.64,66.5; 75 7.64,69.04; 76 7.64,71.58; 77 7.64,74.12; 78 7.64,76.66; 79 5.1,13.16; 80 5.1,15.7; 81 5.1,18.24; 82 5.1,20.78; 83 5.1,23.32; 84 5.1,25.86; 85 5.1,28.4; 86 5.1,30.94; 87 5.1,33.48; 88 5.1,36.02; 89 5.1,38.56; 90 5.1,41.1; 91 5.1,43.64; 92 5.1,46.18; 93 5.1,48.72; 94 5.1,51.26; 95 5.1,53.8; 96 5.1,56.34; 97 5.1,58.88; 98 5.1,61.42; 99 5.1,63.96; 100 5.1,66.5; 101 5.1,69.04; 102 5.1,71.58; 103 5.1,74.12; 104 5.1,76.66 | hole 3.6: 5.13,8.1; 90.86,4.29; 90.86,84.3; 5.13,81.76
1X06 = drill 1.016 pad 1.88: 1 0,0; 2 2.54,0; 3 5.08,0; 4 7.62,0; 5 10.16,0; 6 12.7,0
2X3-NS = drill 1.016 pad 1.88: 1 -2.54,-1.27; 2 -2.54,1.27; 3 0,-1.27; 4 0,1.27; 5 2.54,-1.27; 6 2.54,1.27
1X04 = drill 1.016 pad 1.88: 1 0,0; 2 2.54,0; 3 5.08,0; 4 7.62,0
SCREWTERMINAL-5MM-3 = drill 1.3 pad 2.413 square: 1 0,0 | drill 1.3 pad 2.413: 2 5,0; 3 10,0
1X02 = drill 1.016 pad 1.88: 1 0,0; 2 2.54,0
1X03 = drill 1.016 pad 1.88: 1 0,0; 2 2.54,0; 3 5.08,0
1X03_LOCK = drill 1.016 pad 1.88: 1 0,0.127; 2 2.54,-0.127; 3 5.08,0.127
1X01 = drill 1.016 pad 1.88: 1 0,0
SRN6045 = smd 2.5 x 6: 1 -2.175,0; 2 2.125,0
QS = drill 0.61 long: 1 -2.54,0; 2 2.54,0
AXIAL-0.3 = drill 0.9 pad 1.88 long: P$1 -3.81,0; P$2 3.81,0
AXIAL-0.3' = drill 0.9 pad 1.88: P$1 -3.81,0; P$2 3.81,0
SWITCH_SPDT_PTH_11.6X4.0MM = drill 1.016 pad 1.88: 1 0,2.54; 2 0,0; 3 0,-2.54
TQFP32-08 = smd 1.27 x 0.559: 1 -4.293,2.8; 2 -4.293,2; 3 -4.293,1.2; 4 -4.293,0.4; 5 -4.293,-0.4; 6 -4.293,-1.2; 7 -4.293,-2; 8 -4.293,-2.8; 17 4.293,-2.8; 18 4.293,-2; 19 4.293,-1.2; 20 4.293,-0.4; 21 4.293,0.4; 22 4.293,1.2; 23 4.293,2; 24 4.293,2.8 | smd 0.559 x 1.27: 9 -2.8,-4.293; 10 -2,-4.293; 11 -1.2,-4.293; 12 -0.4,-4.293; 13 0.4,-4.293; 14 1.2,-4.293; 15 2,-4.293; 16 2.8,-4.293; 25 2.8,4.293; 26 2,4.293; 27 1.2,4.293; 28 0.4,4.293; 29 -0.4,4.293; 30 -1.2,4.293; 31 -2,4.293; 32 -2.8,4.293
DRV10987 = smd 0.3 x 1.05: 1 0.3,-0.5; 2 0.95,-0.5; 3 1.6,-0.5; 4 2.25,-0.5; 5 2.9,-0.5; 6 3.55,-0.5; 7 4.2,-0.5; 8 4.85,-0.5; 9 5.5,-0.5; 10 6.15,-0.5; 11 6.8,-0.5; 12 7.45,-0.5; 13 7.45,5; 14 6.8,5; 15 6.15,5; 16 5.5,5; 17 4.85,5; 18 4.2,5; 19 3.55,5; 20 2.9,5; 21 2.25,4.98; 22 1.6,5; 23 0.95,5; 24 0.3,5
XL6009E1_MODULE = drill 1.4 square: IN+ 1.5,19.7; IN- 1.5,1.5; OUT+ 41.9,19.7; OUT- 41.9,1.5 | hole 2.95: 6.66,18.8; 36.74,2.32
CONN_03_SMD_SMALL = smd 0.6 x 1.27: P$1 -0.8,0; P$2 0,0; P$3 0.8,0
WIRELESS-BLUETOOTH-HC-05-MIRROR = drill 1 square: 1 6.35,-17.145 | drill 1: 2 3.81,-17.145; 3 1.27,-17.145; 4 -1.27,-17.145; 5 -3.81,-17.145; 6 -6.35,-17.145

### Placement (x,y rotation side)
C1  70.39,18.61 180 top
C2  63.34,18.8 180 top
C3  56.22,11.95 180 top
C4  63.79,13.36 0 top
C5  60.07,11.96 180 top
C6  70.44,21.74 180 top
C7  25.92,17.81 180 top
C8  25.88,21.46 180 top
C14  43.81,11.65 270 top
C15  48.38,11.73 270 top
CN1  75.93,26.63 270 top
IC4  46.09,20.14 0 top
J1  0.06,0.06 0 top
J2  34.58,21.62 90 top
J3  16.12,7.27 0 top
J4  88.27,20.42 180 top
J5  90.61,13.27 180 top
J6  88.3,39.48 270 top
J7  84.51,39.58 270 top
J8  80.62,39.58 270 top
J9  76.56,39.53 270 top
J10  19.35,73.84 0 top
J11  90.88,48.99 90 top
J12  93.58,51.49 0 top
J13  19.28,57.79 0 top
J14  19.18,44.99 0 top
J15  21.78,42.39 0 top
J16  21.28,60.79 0 top
J17  90.88,45.39 90 top
J18  21.28,37.49 270 top
J19  17.28,37.59 270 top
L1  57.29,17.23 0 top
Q1  19.88,18.9 270 top
R1  64.13,10.18 0 top
R2  61.17,8.14 270 top
R3  35.97,14.7 90 top
R4  78.75,51.54 0 top
R5  78.75,54.93 180 top
R6  10k  [AXIAL-0.3']  88.26,29.18 90 top
R7  10k  [AXIAL-0.3']  84.45,29.18 90 top
R8  10k  [AXIAL-0.3']  80.64,29.18 90 top
S1  87.08,70.4 180 top
S2  80.33,70.38 0 top
U1  27.73,9.5 270 top
U$1  68.25,16.97 270 top
U$2  29.28,67.79 0 top
U$3  29.78,2.49 0 top
U$4  80.94,42.42 180 top

### Tracks (layer width: path | path; a pad name or v marks a point on that pad's centre or on a via)
5V_OUT_STACK  (via drill 0.6 pad 1.4)
  Top 0.508: v75.68,46.19 71.08,50.79 v30.08,50.79
  Top 1.016: v30.08,50.79 30.08,43.39 29.08,42.39 v25.28,42.39
  Bottom 0.508: J12.1 94.48,50.59 94.48,45.49 91.09,42.79 77.38,42.79 75.68,44.49 v75.68,46.19
  Bottom 1.016: J1.52 10.24,78.15 11.08,78.99 25.78,78.99 26.78,77.99 26.78,67.59 30.08,64.29 v30.08,50.79 | J15.1 v25.28,42.39
5V_STACK  (via drill 0.6 pad 1.4)
  Top 0.508: v87.78,54.09 84.58,57.29 31.08,57.29 30.78,57.29 28.78,57.29 23.28,51.79 23.28,46.1 J14.3
  Bottom 0.254: 5.16,43.61 J1.91
  Bottom 0.406: J1.91 J1.65 8.91,42.49 15.78,42.49 17.58,40.69 26.38,40.69 27.98,42.29 v27.98,45.59 27.26,45.12 J14.3
  Bottom 0.508: J11.3 87.8,54.07 v87.78,54.09
5VDC  (via drill 0.6 pad 1.5)
  Top 0.508: IC4.3 50.73,17.04 51.08,17.39 51.08,21.19 53.98,24.09 56.68,24.09 61.28,28.69 65.38,28.69 73.68,36.99 73.68,40.69 75.28,42.29 83.78,42.29 85.78,44.29 v85.78,44.79
  Top 1.016: C15.1 48.38,17.02 IC4.3
  Bottom 0.508: v85.78,44.79 89.98,48.99 J11.1
11.1V_LIPO
  Bottom 0.406: J13.3 24.36,60.16 23.06,61.46 23.06,68.57 24.48,69.99 24.48,73.79 J10.3
12V  (via drill 0.6 pad 1.5)
  Top 0.305: U$1.24 73.38,16.8 | C1.1 71.29,21.69 C6.1
  Top 0.406: U$1.23 U$1.24 | 73.38,16.8 73.38,18.29 73.06,18.61 C1.1
  Top 0.813: v61.48,26.89 64.48,23.89 70.58,23.89 71.34,23.13 C6.1 | 43.79,16.99 43.81,17.01
  Top 1.016: C14.1 43.81,17.01 IC4.1 43.78,20.49 41.68,22.59 v41.68,24.59
  Bottom 0.813: v61.48,26.89 58.96,24.37 41.91,24.37 v41.68,24.59
  Bottom 1.016: S2.3 74.78,62.29 74.08,62.29 69.88,58.09 69.88,40.69 68.88,39.69 64.78,39.69 61.48,36.39 v61.48,26.89
12V_REG  (via drill 0.6 pad 1.4)
  Top 1.016: J13.1 19.28,64.99 20.61,66.32 27.74,66.32 27.77,66.29 33.48,66.29 35.38,68.19 35.38,77.09 v34.98,77.49
  Bottom 1.016: v34.98,77.49 44.98,87.49 U$2.OUT+
+5V  (via drill 0.6 pad 1.4, 0.6 pad 1.5)
  Top 0.305: 26.53,12.64 26.53,12.44 25.73,11.64 | U$3.P$1 28.82,2.66 24.55,2.66
  Top 0.406: v31.18,26.59 28.98,24.39 28.98,19.39 | 28.98,19.39 28.98,16.09 28.13,15.24 U1.4 28.13,12.44 27.88,12.19 26.98,12.19 26.53,12.64 U1.6 | 25.73,11.64 U1.18 25.73,3.84 24.55,2.66 12.62,2.66 11.28,3.99 v11.28,4.39 | R3.2 35.97,18.6 35.18,19.39 28.98,19.39
  Top 0.508: v81.38,45.59 79.58,43.79 66.28,43.79 v66.18,43.69
  Bottom 0.305: 31.23,26.64 v31.18,26.59
  Bottom 0.406: J3.2 12.33,8.54 11.28,7.49 v11.28,4.39 | J2.4 33.83,29.24 v31.18,26.59
  Bottom 0.508: S1.3 85.33,72.94 84.68,72.29 84.68,59.64 U$4.5 85.78,58.54 85.78,49.79 81.58,45.59 v81.38,45.59 | J2.4 42.63,29.24 57.08,43.69 v66.18,43.69
DIR
  Top 0.305: U$1.13 73.25,8.56 72.78,8.09 69.58,8.09 65.88,4.39 60.18,4.39 59.38,5.19 38.38,5.19 36.88,6.69 32.04,6.69 U1.25
FG
  Top 0.305: U$1.12 67.75,7.86 65.18,5.29 60.98,5.29 59.88,6.39 38.28,6.39 37.18,7.49 33.18,7.49 33.17,7.5
  Top 0.406: 33.17,7.5 U1.26
GND  (via drill 0.35, 0.6 pad 1.4, 0.6 pad 1.5)
  Top 0.254: 69.67,12.09 69.38,12.09 68.78,12.09 68.75,12.12 U$1.8 63.25,12.12 62.89,12.48 C4.1 | U$1.15 72.11,10.82 | 72.11,10.82 72.08,10.79 | 72.11,10.82 72.18,10.89 | 72.05,11.47 U$1.16
  Top 0.305: 69.88,11.88 69.67,12.09 | 69.28,12.19 69.38,12.09 | U$1.5 69.45,14.07 | IC4.4 | U1.3 28.98,13.85 | v27.28,25.39 C8.1
  Top 0.406: v30.48,15.89 30.18,15.59 29.68,15.59 28.93,14.84 U1.3 | IC4.4 48.33,23.24 49.5,24.41 49.5,30.67 48.38,31.79 v42.28,31.79
  Top 0.508: C5.1 61.69,13.36 C4.1 | C3.1 57.12,10.53 56.78,10.19 52.98,10.19 52.28,10.89 | C8.1 27.28,17.85 C7.1 U1.5
  Top 0.813: v71.98,11.09 74.08,11.09 74.18,11.19 74.18,11.09
  Top 1.016: C14.2 43.89,10.33 45.98,10.33 | 45.98,10.33 C15.2 51.72,10.33 52.28,10.89 52.28,20.19 53.83,21.74 C6.2 | 45.98,10.33 46.09,10.44 IC4.2 IC4.4 | v30.78,73.19 29.08,73.19 25.58,69.69 v19.38,69.69
  Bottom 0.406: v30.48,15.89 29.98,16.39 29.98,22.69 v27.28,25.39 27.28,28.39 30.68,31.79 J2.5 | v42.28,31.79 J2.5 | J2.5 J2.6 | J1.67 J1.93 J1.94
  Bottom 0.508: U$4.4 82.21,55.28 R5.P$1
  Bottom 1.016: U$2.OUT- 71.18,68.99 69.28,67.09 32.98,67.09 U$2.IN- v30.78,73.19 | v19.38,69.69 19.38,73.81 J10.1
  other vias: 69.18,16.19 70.58,16.19 71.98,16.19 69.18,14.89 70.58,14.89 71.98,14.89 69.18,13.59 70.58,13.59 71.98,13.59 69.18,12.29 70.58,12.29 71.98,12.29 69.18,11.09 70.58,11.09 69.18,9.89 70.58,9.89 71.98,9.89
  pour Bottom: 0.08,0.09 73.28,-0.01 75.88,4.19 86.18,4.19 88.78,0.09 95.98,0.09 95.98,19.79 91.08,22.49 90.88,41.49 95.58,44.99 95.48,54.89 90.48,59.79 90.58,73.19 95.88,78.39 95.78,89.69 26.48,89.99 21.58,85.09 11.28,85.19 7.38,89.09 0.28,89.09 0.18,62.59 2.58,60.29 2.78,24.69 0.08,21.89
  pour Top: 0.18,0.09 73.38,-0.01 75.98,4.09 87.08,3.99 89.28,-0.01 96.48,0.09 96.48,19.79 90.88,23.19 90.98,41.39 95.98,44.99 96.08,55.09 91.08,59.89 91.18,73.29 95.78,77.99 95.88,89.99 25.88,89.99 21.28,85.29 11.88,85.19 7.68,89.69 0.08,89.79 0.28,62.89 2.58,60.79 2.58,24.59 0.28,22.29 0.08,22.09 0.08,0.09
I2C2_SCL
  Bottom 0.406: J1.6 15.31,25.92 17.38,27.99 17.38,32.49 J19.3
I2C2_SDA
  Bottom 0.406: J1.5 17.07,23.38 21.48,27.79 21.48,32.34 J18.3
I2C_SCL  (via drill 0.6 pad 1.4)
  Top 0.406: v37.38,43.29 32.98,43.29 32.48,42.79 32.48,40.79 v32.58,40.69
  Bottom 0.305: v32.58,40.69 31.68,39.79 18.18,39.79 17.41,39.02 J19.1
  Bottom 0.406: J1.22 14.71,66.56 16.78,64.49 16.78,52.89 17.78,51.89 26.78,51.89 29.98,48.69 37.38,48.69 v37.38,43.29
I2C_SCL_UC  (via drill 0.35, 0.6 pad 1.4)
  Top 0.254: U$1.10 66.71,10.82 66.07,10.18 R1.2 63.28,8.43 v63.28,8.39 | v39.08,9.09 36.89,9.09 36.88,9.1
  Top 0.406: U1.28 36.88,9.1 37.19,9.1 37.98,9.89 37.98,18.29 36.28,19.99 33.08,19.99 32.78,20.29 32.78,27.69 32.28,28.19 v20.18,28.19
  Bottom 0.254: v39.08,9.09 39.78,8.39 v63.28,8.39
  Bottom 0.406: v20.18,28.19 19.38,28.99 19.38,33.99 18.32,35.05 J19.2
I2C_SDA
  Bottom 0.305: 12.95,64.19 J1.21 | 32.48,38.59 27.96,38.59 27.6,38.96 22.88,38.96 J18.1
  Bottom 0.406: J1.21 14.05,64.02 15.78,62.29 15.78,52.29 17.78,50.29 26.38,50.29 29.28,47.39 33.68,47.39 34.68,46.39 34.68,39.29 33.98,38.59 32.48,38.59
I2C_SDA_UC
  Top 0.254: U$1.11 66.96,10.17 64.03,7.24 R2.2
  Top 0.406: J18.2 22.57,34.95 24.95,32.57 29.66,32.57 33.58,36.49 35.78,36.49 36.98,35.29 36.98,21.49 40.88,17.59 40.88,7.99 | U1.27 37.59,8.3 38.5,7.39 40.28,7.39 40.88,7.99 | R2.2 41.63,7.24 40.88,7.99
MCU-RX  (via drill 0.6 pad 1.4)
  Top 0.406: U1.30 33.29,10.7 34.18,11.59 34.18,17.39 33.68,17.89 v31.58,17.89
  Bottom 0.406: v31.58,17.89 31.58,24.69 33.59,26.7 J2.3 36.07,26.7 36.98,25.79 36.98,23.99 38.28,22.69 60.78,22.69 71.38,33.29 71.38,45.99 74.98,49.59 78.98,49.59 79.68,50.29 79.68,52.37 79.67,52.38
  Bottom 0.508: 79.67,52.38 U$4.3
MCU-TX  (via drill 0.6 pad 1.4)
  Top 0.406: U1.31 33.09,11.5 33.38,11.79 33.38,14.29 v32.58,15.09
  Bottom 0.406: v32.58,15.09 32.98,15.49 32.98,19.19 32.78,19.39 32.78,23.79 33.15,24.16 J2.2 36.8,21.94 62.33,21.94 72.88,32.49 72.88,45.99 75.38,48.49 80.88,48.49 82.56,50.17 R4.P$2
MISO  (via drill 0.6 pad 1.5)
  Top 0.305: U1.16 23.43,6.69
  Top 0.406: v20.98,3.89 20.98,6.29 21.39,6.7 U1.16
  Bottom 0.254: 20.88,3.79 v20.98,3.89
  Bottom 0.406: J3.1 13.58,4.39 14.18,3.79 20.88,3.79
MOSI  (via drill 0.6 pad 1.5)
  Top 0.406: v16.58,11.29 18.68,11.29 21.87,7.7 22.07,7.5 U1.15
  Bottom 0.305: 16.52,10.73 v16.58,11.29
  Bottom 0.406: J3.4 16.58,9 v16.58,11.29
N$1
  Top 0.406: U$1.1 66.9,16.67 66.38,17.19 66.38,18.29 66.7,18.61 C1.2
N$2
  Top 0.254: U$1.2 66.55,16.02 65.88,16.69 64.78,16.69 64.24,17.23 C2.1
N$3
  Top 0.254: U$1.3 66.4,15.37 65.78,15.99 62.98,15.99 62.48,16.49 62.48,18.76 C2.2
N$4
  Top 0.254: U$1.4 66.35,14.72 65.78,15.29 60.08,15.29 59.68,15.69
  Top 0.305: L1.2 59.42,15.96 59.68,15.69
N$5
  Bottom 0.508: J17.1 91.98,45.39 93.08,46.49 93.08,49.46 J11.2 92.88,53.41 92.88,55.39 89.18,59.09 89.18,69.79 88.57,70.4 S1.2
N$6
  Top 0.254: U$1.6 66.65,13.42 65.58,14.49 61.88,14.49 60.88,13.49 55.25,13.49 | 55.25,13.49 55.25,15.49 | 55.25,13.49 55.25,12.03 C3.2
  Top 0.305: 55.28,14.97 55.25,15.49 55.15,16.79 L1.1
N$7
  Top 0.254: U$1.7 66.3,12.77 65.71,13.36 C4.2
N$8  (via drill 0.6 pad 1.4)
  Top 0.406: U1.7 25.73,15.14 24.52,16.35 24.52,17.69 C7.2
  Top 0.508: v23.28,15.49 24.52,16.73 24.52,17.69
  Bottom 0.508: v23.28,15.49 22.41,16.36 Q1.2
N$9
  Top 0.254: 65.96,11.47 63.18,11.47 62.56,11.47 61.78,10.69 59.58,10.69 59.17,11.1 C5.2
  Top 0.305: U$1.9 65.96,11.47 | R1.1 63.23,11.42 63.18,11.47
  Top 0.508: R2.1 62.31,10.18 R1.1
N$10  (via drill 0.6 pad 1.5)
  Top 0.508: v24.38,25.39 24.38,21.52 24.46,21.44 C8.2 23.35,21.46 22.08,20.19 22.08,14.79 23.08,13.8 U1.8
  Bottom 0.508: Q1.1 19.88,23.79 21.48,25.39 v24.38,25.39
N$11
  Bottom 1.27: R7.P$2 84.45,36.98 J7.2
N$12
  Bottom 1.27: R6.P$2 88.26,36.9 J6.2
N$13
  Bottom 0.305: 76.64,59.08 U$4.2
  Bottom 0.508: R4.P$1 R5.P$2 77.13,57.12 U$4.2
N$14
  Top 0.305: U1.23 29.78,5.16 U$3.P$2
N$15
  Bottom 1.27: R8.P$2 80.64,37.02 J8.2
N$16  (via drill 0.6 pad 1.4)
  Top 1.016: v27.88,53.69 v64.68,53.69
  Bottom 1.016: J16.1 21.82,60.25 J13.2 21.82,55.45 23.58,53.69 v27.88,53.69 | S2.2 78.87,70.38 64.68,56.19 v64.68,53.69
N$18  (via drill 0.6 pad 1.4)
  Top 1.016: v33.18,82.29 36.68,82.29 37.68,81.29 37.68,61.39 35.48,59.19 28.58,59.19 21.78,52.39 v21.78,48.09
  Bottom 1.016: J14.2 21.72,48.03 v21.78,48.09 | v33.18,82.29 30.78,84.69 U$2.IN+
NF
  Bottom 1.27: J6.1 84.61,39.48 J7.1 J8.1 76.61,39.58 J9.1
NR  (via drill 0.6 pad 1.3)
  Top 0.305: CN1.4 75.88,25.48 75.88,24.59 76.48,23.99 v76.88,23.99
  Bottom 0.254: 80.65,21.22 J4.4
  Bottom 0.305: 76.56,24.31 v76.88,23.99 | 80.45,20.42 J4.4
  Bottom 0.406: J9.3 76.56,25.31 76.56,24.31 | v76.88,23.99 80.45,20.42
OUT1  (via drill 0.6 pad 1.3, 0.6 pad 1.5)
  Top 0.305: U$1.17 73.25,12.39 U$1.18 | CN1.1 76.07,27.38 v78.28,29.59
  Top 0.813: v76.48,7.99 75.98,8.49 75.98,11.09 74.68,12.39 73.25,12.39
  Bottom 0.254: 87.78,28.99 87.98,28.79 | 88.28,25.39 R6.P$1
  Bottom 0.406: 88.28,25.39 88.28,28.49 87.98,28.79 87.18,29.59 v78.28,29.59
  Bottom 0.813: J5.1 85.33,7.99 v76.48,7.99
  Bottom 1.27: R6.P$1 J4.1 | J4.1 | J5.1 90.61,15.06 88.26,17.41 J4.1
OUT2  (via drill 0.6 pad 1.3, 0.6 pad 1.5)
  Top 0.305: U$1.19 73.25,13.69 U$1.20 | CN1.2 77.97,26.88 v78.38,27.29
  Top 0.813: v76.18,12.99 75.48,13.69 73.25,13.69
  Bottom 0.406: v78.38,27.29 82.53,27.29 R7.P$1
  Bottom 0.813: J5.2 83.33,10.99 78.18,10.99 v76.18,12.99
  Bottom 1.27: R7.P$1 85.73,24.09 J4.2 85.61,20.3 J5.2
OUT3  (via drill 0.6 pad 1.3, 0.6 pad 1.5)
  Top 0.305: 73.25,14.74 U$1.21 73.23,15.09 73.23,15.35 U$1.22 | v77.98,25.39 76.99,26.38 CN1.3
  Top 0.813: v76.78,18.89 76.78,15.69 76.18,15.09 73.23,15.09
  Bottom 0.305: v77.98,25.39 78,25.37
  Bottom 0.406: 78,25.37 R8.P$1
  Bottom 0.813: J5.3 78.6,13.27 76.78,15.09 v76.78,18.89
  Bottom 1.27: R8.P$1 83.19,22.82 J4.3 83.28,20.33 83.28,16.99 80.61,14.32 J5.3
RESET  (via drill 0.6 pad 1.5)
  Top 0.305: v36.08,10.39 35.97,10.2
  Top 0.406: U1.29 33.39,9.9 35.48,11.99 35.97,11.99 | 35.97,10.2 35.97,11.99 | 35.97,11.99 R3.1
  Bottom 0.406: v36.08,10.39 34.58,10.39
  Bottom 0.508: J3.5 32.79,5.8 34.58,7.59 34.58,10.39 J2.1
SCK  (via drill 0.6 pad 1.5)
  Top 0.406: U1.17 24.93,4.04 24.58,3.69 23.58,3.69 v23.18,4.09
  Bottom 0.305: 16.12,5.15 J3.3
  Bottom 0.406: J3.3 16.12,5.05 16.58,4.59 19.68,4.59 20.28,5.19 22.48,5.19 23.18,4.29 v23.18,4.09
SPEED
  Top 0.305: U$1.14 74.1,10.17 74.68,9.59 74.68,8.29 73.38,6.99 70.08,6.99 66.68,3.59 59.18,3.59 58.48,4.29 37.48,4.29 36.78,4.99 30.75,4.99 U1.24
V_BATT_STACK  (via drill 0.6 pad 1.4)
  Top 0.406: v16.78,67.59 15.78,66.59 v15.78,44.29
  Bottom 0.406: J1.101 J1.75 8.91,67.89 15.08,67.89 16.48,67.89 v16.78,67.59 | J14.1 17.18,45.12 16.86,45.12 16.61,45.12 v15.78,44.29

### Text on the board
tPlace: IN+ | 12V_REG | 12V / DRIVER_SWITCH | 5V / uC_SWITCH | GND | 11.1V_LIPO | ON | OFF | GND | GND | ON | OFF | VIN_DRIVER | 12V_REG | 11V_LIPO | 5V_STACK | 5V_IN_SYS | 5V_REG | 5V_OUT_STACK | VBATT_STACK | 5V_STACK | 5V_IN_SYS | NF | 5V_OUT_STACK | I2C_SELECT | I2C_BUS | GND | I2C_IND | NR | GND | SCL | SDA | +5V | RX | TX | RST | N | OUT3 | OUT2 | OUT1 | GND | +5V | GND | MOSI | GND | +5V | MISO | SCK | RST | +5V